# EAGLE schematic ArduIR (EAGLE 7.2.0)
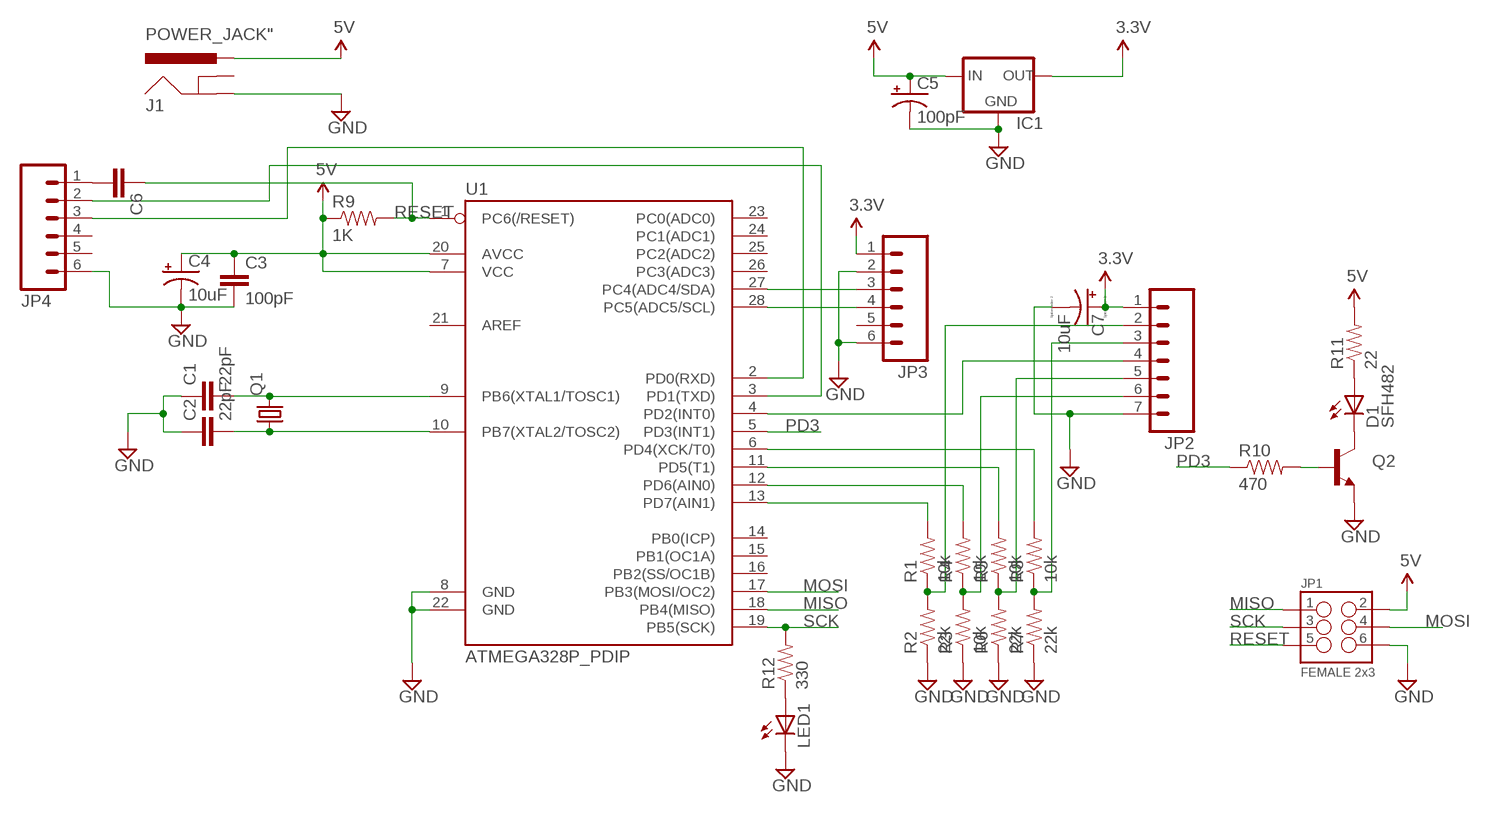
[diagram p0: schematic, sheet 1]

## Parts
C1  22pF  CAPPTH  [CAP-PTH-SMALL]
C2  22pF  CAPPTH  [CAP-PTH-SMALL]
C3  100pF  0.1UF-50V-20%(PTH)KIT-EZ  [CAP-PTH-SMALL-KIT]
C4  10uF  CAP_POLPTH2  [CPOL-RADIAL-10UF-25V]
C5  100pF  CAP_POLPTH2  [CPOL-RADIAL-10UF-25V]
C6  0.1UF-50V-20%(PTH)KIT-EZ  [CAP-PTH-SMALL-KIT]
C7  10uF  CPOL-USE15-5AXIAL  [E15-5]
D1  SFH482  [SFH482]
IC1  REGULATORTO220  [L4931_REGULATOR]
J1  POWER_JACK"  [POWER_JACK]
JP1  FEMALE 2x3  M03X2FEMALE  [2X3]
JP2  M07  [1X07]
JP3  M06SILK_FEMALE_PTH  [1X06]
JP4  M06SILK_FEMALE_PTH  [1X06]
LED1  LED5MM  [LED5MM]
Q1  CRYSTALHC49US  [HC49US]
Q2  TRANSISTOR_NPNTO-92-AMMO  [TO-92-AMMO]
R1  10k  10KOHM-1/4W-1%(PTH)VERT-KIT  [AXIAL-0.1EZ]
R2  22k  10KOHM-1/4W-1%(PTH)VERT-KIT  [AXIAL-0.1EZ]
R3  10k  10KOHM-1/4W-1%(PTH)VERT-KIT  [AXIAL-0.1EZ]
R4  10k  10KOHM-1/4W-1%(PTH)VERT-KIT  [AXIAL-0.1EZ]
R5  10k  10KOHM-1/4W-1%(PTH)VERT-KIT  [AXIAL-0.1EZ]
R6  22k  10KOHM-1/4W-1%(PTH)VERT-KIT  [AXIAL-0.1EZ]
R7  22k  10KOHM-1/4W-1%(PTH)VERT-KIT  [AXIAL-0.1EZ]
R8  10k  10KOHM-1/4W-1%(PTH)VERT-KIT  [AXIAL-0.1EZ]
R9  1K  1KOHM-1/4W-1%(PTH)VERT-KIT  [AXIAL-0.1EZ]
R10  470  1KOHM-1/4W-1%(PTH)HORIZ-KIT  [AXIAL-0.3EZ]
R11  22  1KOHM-1/4W-1%(PTH)HORIZ-KIT  [AXIAL-0.3EZ]
R12  330  10KOHM-1/4W-1%(PTH)VERT-KIT  [AXIAL-0.1EZ]
U1  ATMEGA328P_PDIP  [DIL28-3]

## Nets
3.3V: C7.+ IC1.OUT JP2.1 JP3.1
5V: C3.1 C4.1(+) C5.1(+) IC1.IN J1.PWR JP1.2 R9.P$1 R11.P$2 U1.7(VCC) U1.20(AVCC)
GND: C1.1 C2.1 C3.2 C4.2(-) C5.2(-) C7.- IC1.GND J1.GND JP1.6 JP2.7 JP3.2 JP3.6 JP4.6 LED1.K(C) Q2.1(E) R2.P$1 R3.P$1 R6.P$1 R7.P$1 U1.8(GND) U1.22(GND)
MISO: JP1.1 U1.18(PB4(MISO))
MOSI: JP1.4 U1.17(PB3(MOSI/OC2))
N$1: JP2.2 R1.P$1 R2.P$2
N$2: JP2.6 R3.P$2 R4.P$1
N$3: JP2.5 R5.P$1 R6.P$2
N$4: JP2.3 R7.P$2 R8.P$1
N$5: R8.P$2 U1.6(PD4(XCK/T0))
N$6: R5.P$2 U1.11(PD5(T1))
N$7: R4.P$2 U1.12(PD6(AIN0))
N$8: R1.P$2 U1.13(PD7(AIN1))
N$9: JP2.4 U1.4(PD2(INT0))
N$10: C1.2 Q1.2 U1.9(PB6(XTAL1/TOSC1))
N$11: C2.2 Q1.1 U1.10(PB7(XTAL2/TOSC2))
N$13: JP3.3 U1.27(PC4(ADC4/SDA))
N$14: JP3.4 U1.28(PC5(ADC5/SCL))
N$15: Q2.2(B) R10.P$2
N$16: D1.K(C) Q2.3(C)
N$17: D1.A R11.P$1
N$18: LED1.A R12.P$1
N$22: C6.2 JP4.1
N$23: JP4.2 U1.3(PD1(TXD))
N$24: JP4.3 U1.2(PD0(RXD))
PD3: R10.P$1 U1.5(PD3(INT1))
RESET: C6.1 JP1.5 R9.P$2 U1.1(PC6(/RESET))
SCK: JP1.3 R12.P$2 U1.19(PB5(SCK))
Unconnected: J1.GNDBREAK JP3.5 JP4.4 JP4.5 U1.14(PB0(ICP)) U1.15(PB1(OC1A)) U1.16(PB2(SS/OC1B)) U1.21(AREF) U1.23(PC0(ADC0)) U1.24(PC1(ADC1)) U1.25(PC2(ADC2)) U1.26(PC3(ADC3))

## Library data of the parts
C1 C2 = SparkFun-Capacitors:CAP: Capacitor Standard 0603 ceramic capacitor, and 0.1" leaded capacitor.
C3 C6 = SparkFun-Capacitors:0.1UF-50V-20%(PTH): CAP-08370; PROD_ID: CAP-08370
C4 C5 = SparkFun-Capacitors:CAP_POL: Capacitor Polarized These are standard SMD and PTH capacitors. Normally 10uF, 47uF, and 100uF in electrolytic and tantalum varieties. Always verify the external diameter of the through hole cap, it varies with capacity, voltage, and manufacturer. The EIA devices should be standard.
C7 = resistor:CPOL-US: POLARIZED CAPACITOR, American symbol
D1 = led:SFH482: IR LED infrared emitting diode, Infineon
IC1 = RBBB:REGULATOR: VOLTAGE REGULATOR
J1 = RBBB:POWER_JACK: Power Jack This is the standard 5.5mm barrel jack for power. The PTH is the most common, proven, reliable, footprint. All others are experimental. The Slot footprint only works if the mill layer is transmitted to the PCB fab house so be warned. Spark Fun Electronics SKU : PRT-00119. Mating wall wart : TOL-00298 (and others)
JP1 = SparkFun-Connectors:M03X2: 2x3 .1" header. Shrouded, with keying- CONN-10681 SMT- CONN-11415 Pogo pins- HW-11044; PROD_ID: CONN-11566
JP2 = SparkFun-Connectors:M07: Header 7 Standard 7-pin 0.1" header. Use with straight break away headers (SKU : PRT-00116), right angle break away headers (PRT-00553), swiss pins (PRT-00743), machine pins (PRT-00117), and female headers (PRT-00115). NOTES ON THE VARIANTS LOCK and LOCK_LONGPADS... This footprint was designed to help hold the alignment of a through-hole component (i.e. 7-pin header) while soldering it into place. You may notice that each hole has been shifted either up or down by 0.005 of an inch from it's more standard position (which is usually a perfectly straight line). This slight alteration caused the pins (the squares in the middle) to touch the edges of the holes. Because they are alternating, it causes a "brace" to hold the header in place. 0.005 has proven to be the perfect amount of "off-center" position when using our standard breakaway headers. Although looks a little odd when you look at the bare footprint, once you have a header in there, the alteration is very hard to notice. Also, if you push a header all the way into place, it is covered up entirely on the bottom side. This idea of altering the position of holes to aid alignment will be further integrated into the Sparkfun Library for other footprints. It can help hold any component with 3 or more connection pins.
JP3 JP4 = SparkFun-Connectors:M06: Header 6 Standard 6-pin 0.1" header. Use with straight break away headers (SKU : PRT-00116), right angle break away headers (PRT-00553), swiss pins (PRT-00743), machine pins (PRT-00117), and female headers (PRT-00115). Molex polarized connector foot print use with SKU : PRT-08094 with associated crimp pins and housings. NOTES ON THE VARIANTS LOCK and LOCK_LONGPADS... This footprint was designed to help hold the alignment of a through-hole component (i.e. 6-pin header) while soldering it into place. You may notice that each hole has been shifted either up or down by 0.005 of an inch from it's more standard position (which is a perfectly straight line). This slight alteration caused the pins (the squares in the middle) to touch the edges of the holes. Because they are alternating, it causes a "brace" to hold the component in place. 0.005 has proven to be the perfect amount of "off-center" position when using our standard breakaway headers. Although looks a little odd when you look at the bare footprint, once you have a header in there, the alteration is very hard to notice. Also,if you push a header all the way into place, it is covered up entirely on the bottom side. This idea of altering the position of holes to aid alignment will be further integrated into the Sparkfun Library for other footprints. It can help hold any component with 3 or more connection pins.; PROD_ID: CONN-08437
LED1 = led:LED: LED OSRAM: - CHIPLED LG R971, LG N971, LY N971, LG Q971, LY Q971, LO R971, LY R971 LH N974, LH R974 LS Q976, LO Q976, LY Q976 LO Q996 - Hyper CHIPLED LW Q18S LB Q993, LB Q99A, LB R99A - SideLED LS A670, LO A670, LY A670, LG A670, LP A670 LB A673, LV A673, LT A673, LW A673 LH A674 LY A675 LS A676, LA A676, LO A676, LY A676, LW A676 LS A679, LY A679, LG A679 - Hyper Micro SIDELED® LS Y876, LA Y876, LO Y876, LY Y876 LT Y87S - SmartLED LW L88C, LW L88S LB L89C, LB L89S, LG L890 LS L89K, LO L89K, LY L89K LS L896, LA L896, LO L896, LY L896 - TOPLED LS T670, LO T670, LY T670, LG T670, LP T670 LSG T670, LSP T670, LSY T670, LOP T670, LYG T670 LG T671, LOG T671, LSG T671 LB T673, LV T673, LT T673, LW T673 LH T674 LS T676, LA T676, LO T676, LY T676, LB T676, LH T676, LSB T676, LW T676 LB T67C, LV T67C, LT T67C, LS T67K, LO T67K, LY T67K, LW E67C LS E67B, LA E67B, LO E67B, LY E67B, LB E67C, LV E67C, LT E67C LW T67C LS T679, LY T679, LG T679 LS T770, LO T770, LY T770, LG T770, LP T770 LB T773, LV T773, LT T773, LW T773 LH T774 LS E675, LA E675, LY E675, LS T675 LS T776, LA T776, LO T776, LY T776, LB T776 LHGB T686 LT T68C, LB T68C - Hyper Mini TOPLED® LB M676 - Mini TOPLED Santana® LG M470 LS M47K, LO M47K, LY M47K Source: http://www.osram.convergy.de LUXEON: - LUMILED® LXK2-PW12-R00, LXK2-PW12-S00, LXK2-PW14-U00, LXK2-PW14-V00 LXK2-PM12-R00, LXK2-PM12-S00, LXK2-PM14-U00 LXK2-PE12-Q00, LXK2-PE12-R00, LXK2-PE12-S00, LXK2-PE14-T00, LXK2-PE14-U00 LXK2-PB12-K00, LXK2-PB12-L00, LXK2-PB12-M00, LXK2-PB14-N00, LXK2-PB14-P00, LXK2-PB14-Q00 LXK2-PR12-L00, LXK2-PR12-M00, LXK2-PR14-Q00, LXK2-PR14-R00 LXK2-PD12-Q00, LXK2-PD12-R00, LXK2-PD12-S00 LXK2-PH12-R00, LXK2-PH12-S00 LXK2-PL12-P00, LXK2-PL12-Q00, LXK2-PL12-R00 Source: www.luxeon.com KINGBRIGHT: KA-3528ASYC Source: www.kingbright.com
Q1 = SparkFun-FreqCtrl:CRYSTAL: Various standard crystals. Proven footprints.
Q2 = SparkFun-DiscreteSemi:TRANSISTOR_NPN: Generic NPN BJT MMBT2222A - TRANS-08049 (SOT-23, 1A 40V) MPSA42 - TRANS-09116 (SOT-23, 500mA 300V) MMBT5088LT1G - TRANS-11160 (SOT-23, 50 mA 30V) BC547 - COM-08928 <http://www.sparkfun.com/products/8928> (TO-92 45V 100mA) (1.Collector 2.Base 3.Emitter) 2N3904 - COM-00521 <http://www.sparkfun.com/products/521> (TO-92 40V 200mA) (1.Emitter 2.Base 3.Collector) P2N2222A - COM-12852 <http://www.sparkfun.com/products/12852> (TO-92 40V 600mA) (1.Collector 2.Base 3.Emitter)
R1 R3-R5 R8 = SparkFun-Resistors:10KOHM-1/4W-1%(PTH): RES-12183; PROD_ID: RES-12183
R2 R6 R7 R12 = SparkFun-Resistors:10KOHM-1/4W-1%(PTH): RES-12183; PROD_ID: RES-12183; VALUE: 10k
R9 = SparkFun-Resistors:1KOHM-1/4W-1%(PTH): RES-12182; PROD_ID: RES-12182
R10 R11 = SparkFun-Resistors:1KOHM-1/4W-1%(PTH): RES-12182; PROD_ID: RES-12182; VALUE: 1K
U1 = SparkFun-DigitalIC:ATMEGA328P_PDIP: uC used in the Arduino 32kb flash, 1k EEPROM, 2k SRAM This is the through-hole version of this chip.